# EasyEDA Pro project smart-switch-v2.eprj, schematic main-board
Board Name: main-board; Create Date: 2025-08-24; Page Name: main-board; Project Name: smart-switch-v2; Schematic Name: main-board; Update Date: 2025-10-11; Version: V1.0
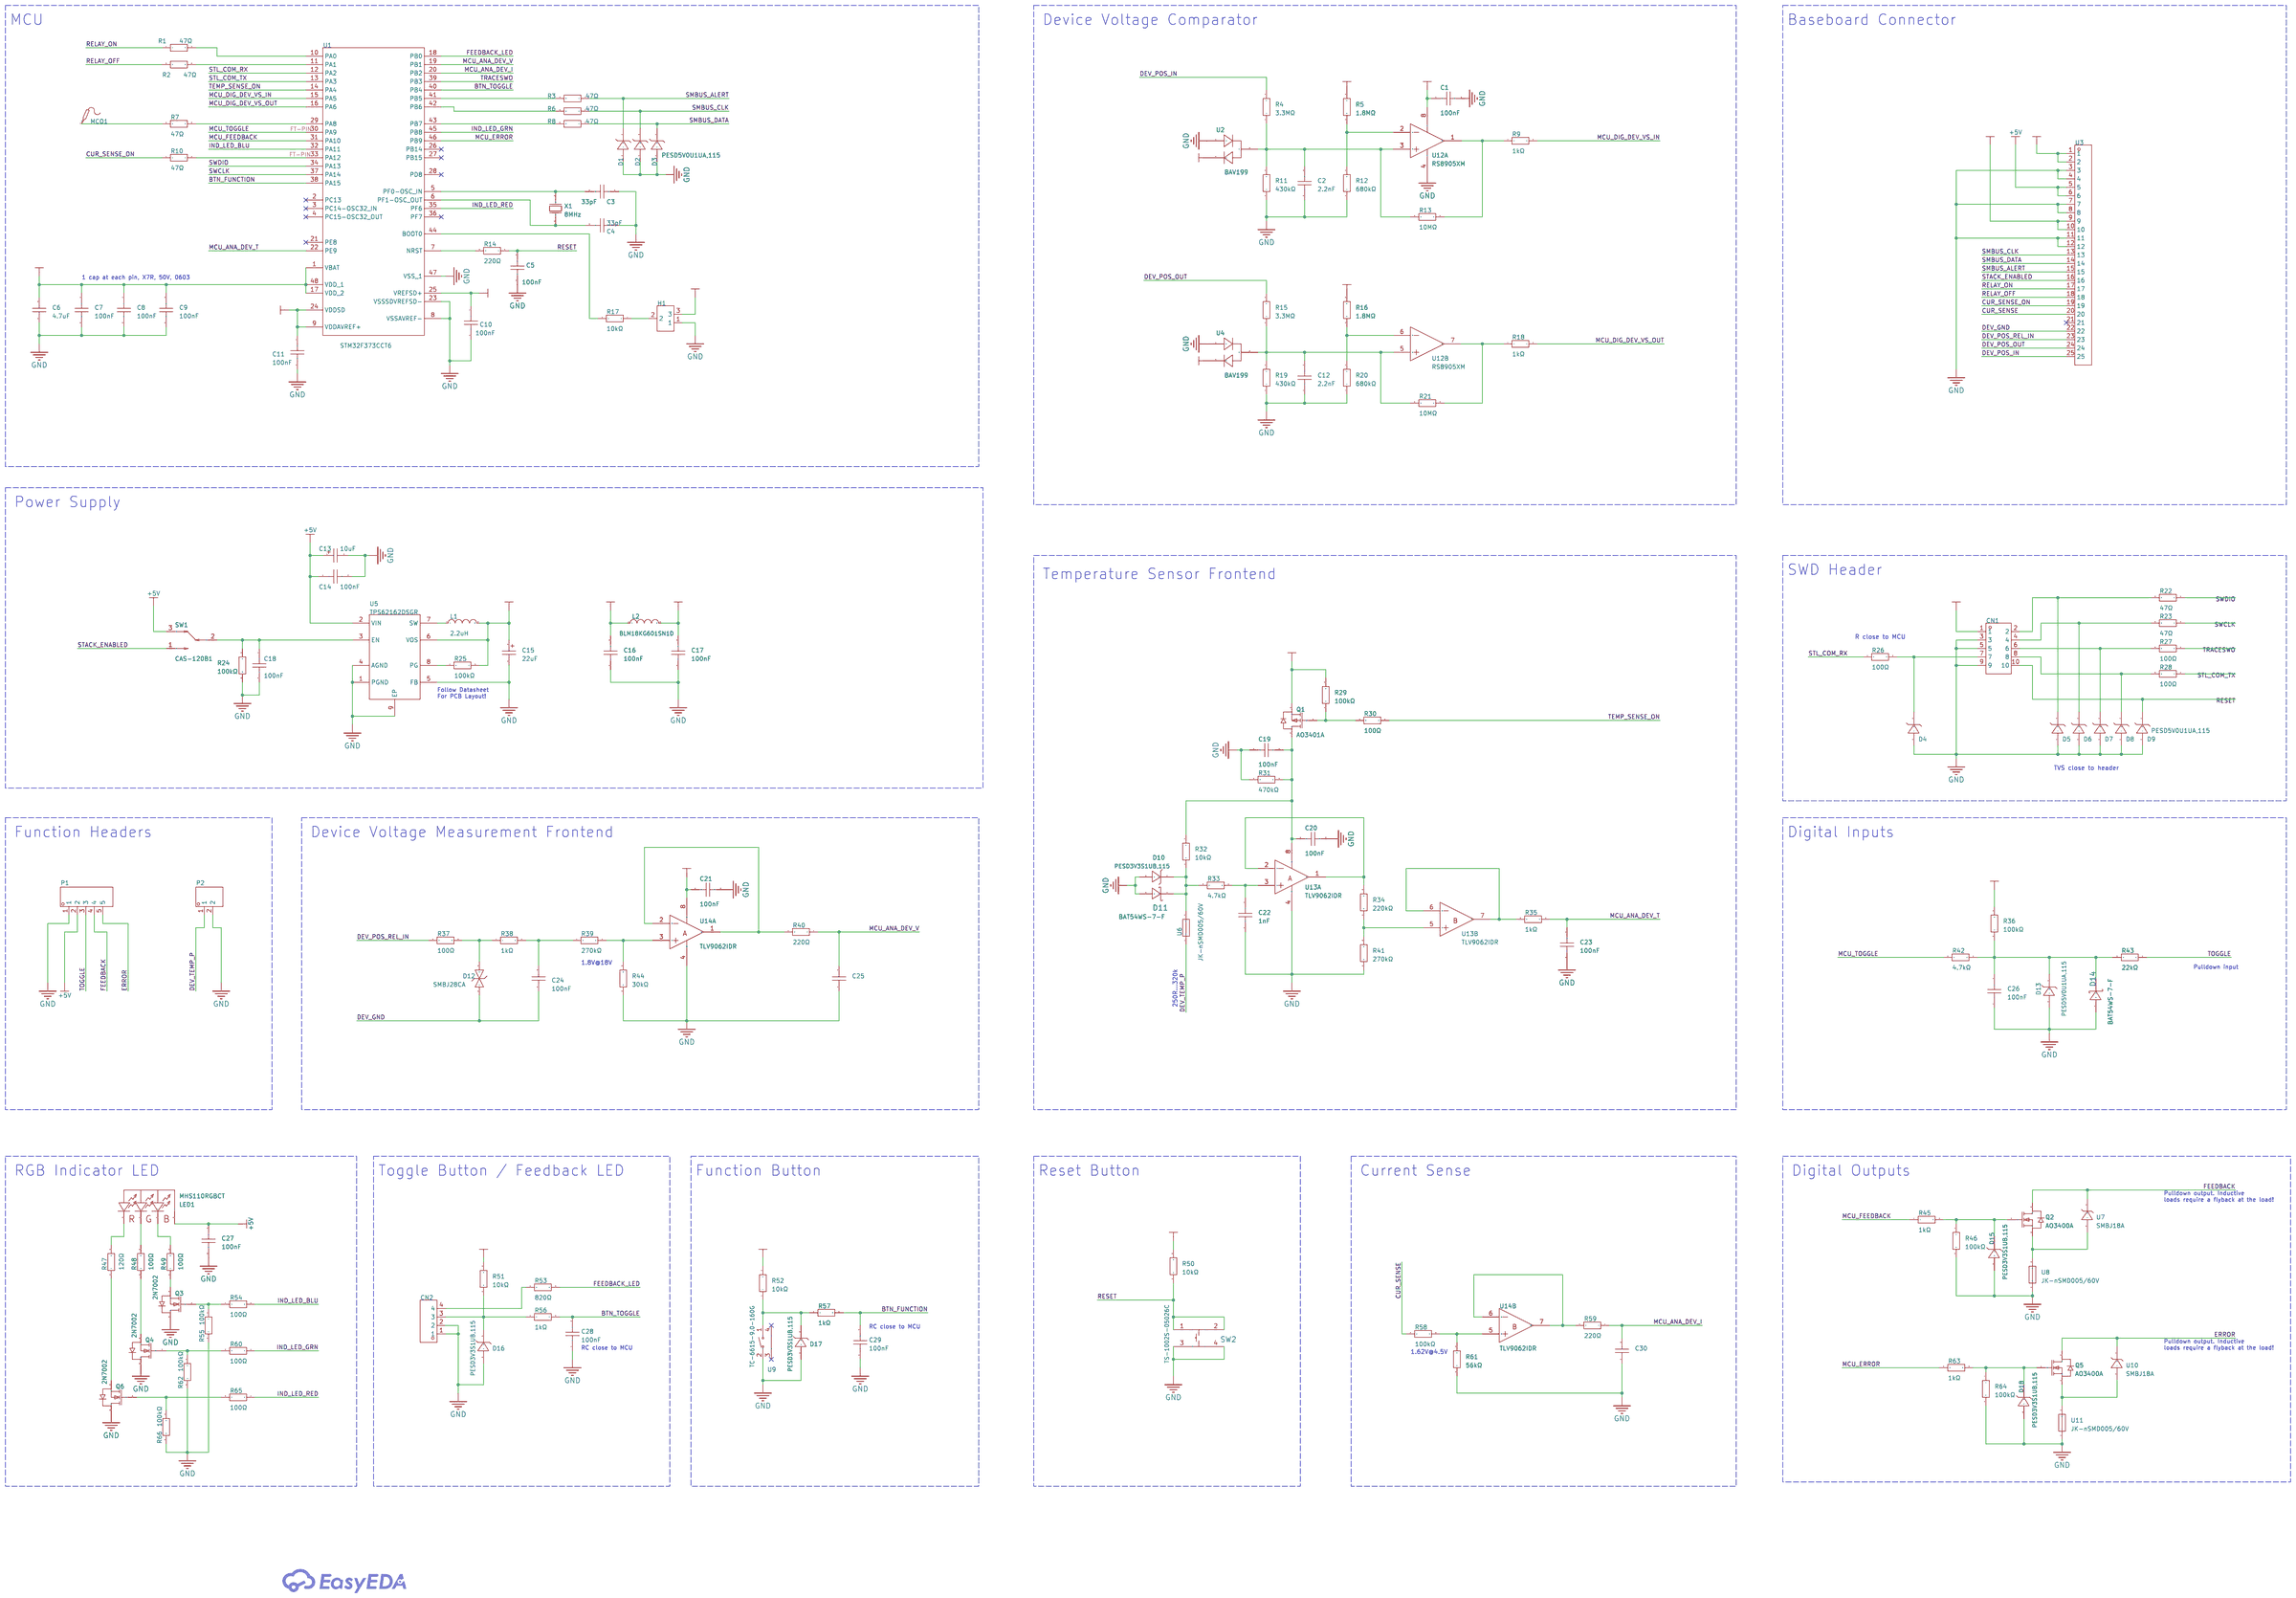
[diagram p0: schematic sheet]

## Parts
C1  100nF  [C0603]
C2  2.2nF  [C0603]
C3  33pF  [C0603]
C4  33pF  [C0603]
C5  100nF  [C0603]
C6  4.7uF  [C0805]
C7  100nF  [C0603]
C8  100nF  [C0603]
C9  100nF  [C0603]
C10  100nF  [C0603]
C11  100nF  [C0603]
C12  2.2nF  [C0603]
C13  10uF  [C0805]
C14  100nF  [C0603]
C15  22uF  [C1206]
C16  100nF  [C0603]
C17  100nF  [C0603]
C18  100nF  [C0603]
C19  100nF  [C0603]
C20  100nF  [C0603]
C21  100nF  [C0603]
C22  1nF  [C0603]
C23  100nF  [C0603]
C24  100nF  [C0805]
C25  22nF  [C0603]
C26  100nF  [C0603]
C27  100nF  [C0603]
C28  100nF  [C0603]
C29  100nF  [C0603]
C30  22nF  [C0603]
CN1  X9555WR-2x05-6TV01  [IDC-TH_10P-P2.54-H-R2-C5-S2.54]
CN2  ZX-XH2.54-4PZZ  [CONN-TH_4P-P2.50_4PIN]
D1  PESD5V0U1UA,115  [SOD-323_L1.8-W1.3-LS2.5-RD]
D2  PESD5V0U1UA,115  [SOD-323_L1.8-W1.3-LS2.5-RD]
D3  PESD5V0U1UA,115  [SOD-323_L1.8-W1.3-LS2.5-RD]
D4  PESD5V0U1UA,115  [SOD-323_L1.8-W1.3-LS2.5-RD]
D5  PESD5V0U1UA,115  [SOD-323_L1.8-W1.3-LS2.5-RD]
D6  PESD5V0U1UA,115  [SOD-323_L1.8-W1.3-LS2.5-RD]
D7  PESD5V0U1UA,115  [SOD-323_L1.8-W1.3-LS2.5-RD]
D8  PESD5V0U1UA,115  [SOD-323_L1.8-W1.3-LS2.5-RD]
D9  PESD5V0U1UA,115  [SOD-323_L1.8-W1.3-LS2.5-RD]
D10  PESD3V3S1UB,115  [SOD-523_L1.2-W0.8-LS1.6-RD]
D11  BAT54WS-7-F  [SOD-323_L1.8-W1.3-LS2.5-RD]
D12  SMBJ28CA  [SMB_L4.6-W3.6-LS5.3-BI]
D13  PESD5V0U1UA,115  [SOD-323_L1.8-W1.3-LS2.5-RD]
D14  BAT54WS-7-F  [SOD-323_L1.8-W1.3-LS2.5-RD]
D15  PESD3V3S1UB,115  [SOD-523_L1.2-W0.8-LS1.6-RD]
D16  PESD3V3S1UB,115  [SOD-523_L1.2-W0.8-LS1.6-RD]
D17  PESD3V3S1UB,115  [SOD-523_L1.2-W0.8-LS1.6-RD]
D18  PESD3V3S1UB,115  [SOD-523_L1.2-W0.8-LS1.6-RD]
H1  X6511WVS-03H-C60D48R2  [HDR-SMD_3P-P2.54_XKB_X6511WVS-03H-C60D48R2]
L1  2.2uH  [IND-SMD_L2.0-W1.6-1]
L2  BLM18KG601SN1D  [L0603]
LED1  MHS110RGBCT  [LED-ARRAY-SMD_MHS110RGBCT]
MCO1  -  [Test-Point-0.5mm]
P1  WJ15EDGRC-3.81-5P  [CONN-TH_5P-P3.81_WJ15EDGRC-3.81-5P]
P2  WJ15EDGRC-3.81-2P  [CONN-TH_2P-P3.81_WJ15EDGRC-3.81-2P]
Q1  AO3401A  [SOT-23_L2.9-W1.3-P1.90-LS2.4-BR]
Q2  AO3400A  [SOT-23-3_L2.9-W1.3-P1.90-LS2.4-BR]
Q3  2N7002  [SOT-23-3_L2.9-W1.3-P1.90-LS2.4-BR]
Q4  2N7002  [SOT-23-3_L2.9-W1.3-P1.90-LS2.4-BR]
Q5  AO3400A  [SOT-23-3_L2.9-W1.3-P1.90-LS2.4-BR]
Q6  2N7002  [SOT-23-3_L2.9-W1.3-P1.90-LS2.4-BR]
R1  47Ω  [R0603]
R2  47Ω  [R0603]
R3  47Ω  [R0603]
R4  3.3MΩ  [R0603]
R5  1.8MΩ  [R0603]
R6  47Ω  [R0603]
R7  47Ω  [R0603]
R8  47Ω  [R0603]
R9  1kΩ  [R0603]
R10  47Ω  [R0603]
R11  430kΩ  [R0603]
R12  680kΩ  [R0603]
R13  10MΩ  [R0603]
R14  220Ω  [R0603]
R15  3.3MΩ  [R0603]
R16  1.8MΩ  [R0603]
R17  10kΩ  [R0603]
R18  1kΩ  [R0603]
R19  430kΩ  [R0603]
R20  680kΩ  [R0603]
R21  10MΩ  [R0603]
R22  47Ω  [R0603]
R23  47Ω  [R0603]
R24  100kΩ  [R0603]
R25  100kΩ  [R0603]
R26  100Ω  [R0603]
R27  100Ω  [R0603]
R28  100Ω  [R0603]
R29  100kΩ  [R0603]
R30  100Ω  [R0603]
R31  470kΩ  [R0603]
R32  10kΩ  [R0603]
R33  4.7kΩ  [R0603]
R34  220kΩ  [R0603]
R35  1kΩ  [R0603]
R36  100kΩ  [R0603]
R37  100Ω  [R1206]
R38  1kΩ  [R0603]
R39  270kΩ  [R0603]
R40  220Ω  [R0603]
R41  270kΩ  [R0603]
R42  4.7kΩ  [R0603]
R43  22kΩ  [R0603]
R44  30kΩ  [R0603]
R45  1kΩ  [R0603]
R46  100kΩ  [R0603]
R47  120Ω  [R0603]
R48  100Ω  [R0603]
R49  100Ω  [R0603]
R50  10kΩ  [R0603]
R51  10kΩ  [R0603]
R52  10kΩ  [R0603]
R53  820Ω  [R0603]
R54  100Ω  [R0603]
R55  100kΩ  [R0603]
R56  1kΩ  [R0603]
R57  1kΩ  [R0603]
R58  100kΩ  [R0603]
R59  220Ω  [R0603]
R60  100Ω  [R0603]
R61  56kΩ  [R0603]
R62  100kΩ  [R0603]
R63  1kΩ  [R0603]
R64  100kΩ  [R0603]
R65  100Ω  [R0603]
R66  100kΩ  [R0603]
SW1  CAS-120B1  [SW-SMD_NIDEC_CAS-120B1]
SW2  TS-1002S-05026C  [KEY-SMD_4P-L6.0-W6.0-P4.50-LS9.0]
U1  STM32F373CCT6  [LQFP-48_L7.0-W7.0-P0.50-LS9.0-BL]
U2  BAV199  [SOT-23-3_L2.9-W1.3-P0.95-LS2.4-BR]
U3  KH-2PH90-1X25P-L10.5  [HDR-TH_25P-P2.00-H-M-W7.5-N]
U4  BAV199  [SOT-23-3_L2.9-W1.3-P0.95-LS2.4-BR]
U5  TPS62162DSGR  [WSON-8_L2.0-W2.0-P0.50-TL-EP]
U6  JK-nSMD005/60V  [F1206]
U7  SMBJ18A  [SMB_L4.5-W3.6-LS5.4-RD]
U8  JK-nSMD005/60V  [F1206]
U9  TC-6615-9.0-160G  [KEY-TH_PTS645VXX83XLFS]
U10  SMBJ18A  [SMB_L4.5-W3.6-LS5.4-RD]
U11  JK-nSMD005/60V  [F1206]
U12  RS8905XM  [MSOP-8_L3.0-W3.0-P0.65-LS4.9-BL]  (sections 1,2)
U13  TLV9062IDR  [SOIC-8_L5.0-W4.0-P1.27-LS6.0-BL]  (sections 1,2)
U14  TLV9062IDR  [SOIC-8_L5.0-W4.0-P1.27-LS6.0-BL]  (sections 1,2)
X1  8MHz  [CRYSTAL-SMD_L5.0-W3.2]

## Library data of the parts
C1 C5 C7-C11 C14 C16-C21 C23 C26-C29 = CC0603KRX7R9BB104: Capacitance:100nF Tolerance:±10% Tolerance:±10% Voltage Rating:50V Temperature Coefficient:X7R; LCSC Part Name: 100nF ±10% 50V; Supplier Part: C14663; Manufacturer: YAGEO(国巨); Supplier Footprint: 0603; JLCPCB Part Class: Basic Part; Datasheet: https://item.szlcsc.com/datasheet/CC0603KRX7R9BB104/15331.html; Supplier: LCSC; Tolerance: ±10%; Voltage Rating: 50V; Temperature Coefficient: X7R
C2 C12 = 0603B222K500NT: Capacitance:2.2nF Tolerance:±10% Tolerance:±10% Voltage Rating:50V Temperature Coefficient:X7R; LCSC Part Name: 2.2nF ±10% 50V; Supplier Part: C1604; Manufacturer: FH(风华); Supplier Footprint: 0603; JLCPCB Part Class: Basic Part; Datasheet: https://item.szlcsc.com/datasheet/0603B222K500NT/1956.html; Supplier: LCSC; Tolerance: ±10%; Voltage Rating: 50V; Temperature Coefficient: X7R
C3 C4 = CL10C330JB8NNNC: Capacitance:33pF Tolerance:±5% Tolerance:±5% Voltage Rating:50V Temperature Coefficient:C0G; LCSC Part Name: 33pF ±5% 50V; Supplier Part: C1663; Manufacturer: SAMSUNG(三星); Supplier Footprint: 0603; JLCPCB Part Class: Basic Part; Datasheet: https://item.szlcsc.com/datasheet/CL10C330JB8NNNC/2015.html; Supplier: LCSC; Tolerance: ±5%; Voltage Rating: 50V; Temperature Coefficient: C0G
C6 = CL21A475KAQNNNE: Capacitance:4.7uF Tolerance:±10% Tolerance:±10% Voltage Rating:25V Temperature Coefficient:X5R; LCSC Part Name: 4.7uF ±10% 25V; Supplier Part: C1779; Manufacturer: SAMSUNG(三星); Supplier Footprint: 0805; JLCPCB Part Class: Basic Part; Datasheet: https://item.szlcsc.com/datasheet/CL21A475KAQNNNE/2131.html; Supplier: LCSC; Tolerance: ±10%; Voltage Rating: 25V; Temperature Coefficient: X5R
C13 = CL21A106KAYNNNE_C15850: Capacitance:10uF Tolerance:±10% Tolerance:±10% Voltage Rating:25V Temperature Coefficient:X5R; LCSC Part Name: 10uF ±10% 25V; Supplier Part: C15850; Manufacturer: SAMSUNG(三星); Manufacturer Part: CL21A106KAYNNNE; Supplier Footprint: 0805; JLCPCB Part Class: Basic Part; Datasheet: https://item.szlcsc.com/datasheet/CL21A106KAYNNNE/16532.html; Supplier: LCSC; Tolerance: ±10%; Voltage Rating: 25V; Temperature Coefficient: X5R
C15 = CL31A226KAHNNNE: Capacitance:22uF Tolerance:±10% Tolerance:±10% Voltage Rating:25V Temperature Coefficient:X5R; LCSC Part Name: 22uF ±10% 25V; Supplier Part: C12891; Manufacturer: SAMSUNG(三星); Supplier Footprint: 1206; JLCPCB Part Class: Basic Part; Datasheet: https://item.szlcsc.com/datasheet/CL31A226KAHNNNE/13537.html; Supplier: LCSC; Tolerance: ±10%; Voltage Rating: 25V; Temperature Coefficient: X5R
C22 = CL10B102KB8NNNC: Capacitance:1nF Tolerance:±10% Tolerance:±10% Voltage Rating:50V Temperature Coefficient:X7R; LCSC Part Name: 1nF ±10% 50V; Supplier Part: C1588; Manufacturer: SAMSUNG(三星); Supplier Footprint: 0603; JLCPCB Part Class: Basic Part; Datasheet: https://item.szlcsc.com/datasheet/CL10B102KB8NNNC/1940.html; Supplier: LCSC; Tolerance: ±10%; Voltage Rating: 50V; Temperature Coefficient: X7R
C24 = CL21B104KCFNNNE: LCSC Part Name: 100nF ±10% 100V; Supplier Part: C28233; Manufacturer: SAMSUNG(三星); Supplier Footprint: 0805; JLCPCB Part Class: Basic Part; Datasheet: https://item.szlcsc.com/datasheet/CL21B104KCFNNNE/28983.html; Supplier: LCSC; Tolerance: ±10%; Voltage Rating: 100V; Temperature Coefficient: X7R
C25 C30 = CL10B223KB8NNNC: Capacitance:22nF Tolerance:±10% Tolerance:±10% Voltage Rating:50V Temperature Coefficient:X7R; LCSC Part Name: 22nF ±10% 50V; Supplier Part: C21122; Manufacturer: SAMSUNG(三星); Supplier Footprint: 0603; JLCPCB Part Class: Basic Part; Datasheet: https://item.szlcsc.com/datasheet/CL10B223KB8NNNC/21834.html; Supplier: LCSC; Tolerance: ±10%; Voltage Rating: 50V; Temperature Coefficient: X7R
CN1 = X9555WR-2x05-6TV01: LCSC Part Name: 2x5P 间距:2.54mm 弯插; Supplier Part: C2682217; Manufacturer: XKB Connection(中国星坤); Supplier Footprint: 弯插,P=2.54mm; JLCPCB Part Class: Extended Part; Datasheet: https://atta.szlcsc.com/upload/public/pdf/source/20211009/ED69AC5D0B165AFEE3838F4DF324EF6E.pdf; Supplier: LCSC; Pins Structure: 2x5P; Pitch: 2.54mm; Mounting Style: Bend-in; Number of Pins: 10P; Number of Rows: 2; Number of PINs Per Row: 5; Row Spacing: 2.54mm; Current Rating (Max): 3A; Contact Material: Brass; Contact Plating: Tin
CN2 = ZX-XH2.54-4PZZ: LCSC Part Name: 1x4P 间距:2.5mm 直插 系列:XH; Supplier Part: C7429634; Manufacturer: Megastar(兆星); Supplier Footprint: 插件,P=2.5mm; JLCPCB Part Class: Extended Part; Datasheet: https://item.szlcsc.com/datasheet/ZX-XH2.54-4PZZ/8427551.html; Supplier: LCSC; Pins Structure: 1x4P; Pitch: 2.5mm; Mounting Type: Through Hole; Reference Series: XH; Number of Pins: 4P; Number of Rows: 1; Number of PINs Per Row: 4; Current Rating: 3A; Contact Material: Brass; Contact Plating: Tin; Operating Temperature: -25℃~+85℃; Voltage Rating: 250V; Plastic Material: PA66; Flame Retardant Rating: UL94V-0; Color: White; Z-Height of the Board: 7mm; X-Length of Bottom Edge on Board (Spacing Line): 12.5mm; Y-Width of Bottom Edge on Board: 5.9mm
D1-D9 D13 = PESD5V0U1UA,115: LCSC Part Name: 单向ESD; Supplier Part: C139614; Manufacturer: Nexperia(安世); Supplier Footprint: SOD-323; JLCPCB Part Class: Extended Part; Datasheet: https://item.szlcsc.com/datasheet/PESD5V0U1UA%252C115/150939.html; Supplier: LCSC; Polarity: Unidirectional; Reverse Stand-Off Voltage (Vrwm): 5V; Clamping Voltage: 11V; Peak Pulse Current (Ipp): 1.3A@8/20us; Voltage - Breakdown: 8.8V; Reverse Leakage Current (Ir): 1nA; Number of Channels: 1; Operating Temperature: -55℃~+150℃@(Ta); level of protection: IEC 61000-4-2; Type: ESD; Junction Capacitance: 2pF
D10 D15-D18 = PESD3V3S1UB,115: LCSC Part Name: 单向ESD; Supplier Part: C85377; Manufacturer: Nexperia(安世); Supplier Footprint: SC-79(SOD-523); JLCPCB Part Class: Extended Part; Datasheet: https://item.szlcsc.com/datasheet/PESD3V3S1UB%252C115/86550.html; Supplier: LCSC; Polarity: Unidirectional; Reverse Stand-Off Voltage (Vrwm): 3.3V; Clamping Voltage: 20V; Peak Pulse Current (Ipp): 18A; Peak Pulse Power Dissipation (Ppp): 330W; Voltage - Breakdown: 5.2V; Number of Channels: 1; Operating Temperature: -65℃~+150℃@(Ta); Type: ESD
D11 D14 = BAT54WS-7-F: LCSC Part Name: 电压:30V 电流:100mA; Supplier Part: C124205; Manufacturer: DIODES(美台); Supplier Footprint: SOD-323; JLCPCB Part Class: Extended Part; Datasheet: https://item.szlcsc.com/datasheet/BAT54WS-7-F/125480.html; Supplier: LCSC; Voltage - Forward(Vf@If): 1V@100mA; Voltage - DC Reverse(Vr): 30V; Current - Rectified: 100mA; Reverse Leakage Current (Ir): 2uA@25V; Non-Repetitive Peak Forward Surge Current: 600mA
D12 = SMBJ28CA_C726872: LCSC Part Name: 双向TVS 28V截止 峰值浪涌电流：13.3A@10/1000us; Supplier Part: C726872; Manufacturer: TWGMC(迪嘉); Supplier Footprint: DO-214AA(SMB); JLCPCB Part Class: Extended Part; Datasheet: https://item.szlcsc.com/datasheet/SMBJ28CA/773977.html; Supplier: LCSC; Polarity: Bidirectional; Reverse Stand-Off Voltage (Vrwm): 28V; Clamping Voltage: 45.4V; Peak Pulse Current (Ipp): 13.3A@10/1000us; Peak Pulse Power Dissipation (Ppp): 600W@10/1000us; Voltage - Breakdown: 34.4V; Reverse Leakage Current (Ir): 1uA; Operating Temperature: -65℃~+150℃; Type: TVS; Junction Capacitance: 390pF
H1 = X6511WVS-03H-C60D48R2: LCSC Part Name: 1x3P 间距:2.54mm 方针; Supplier Part: C2883760; Manufacturer: XKB Connection(中国星坤); Supplier Footprint: SMD,P=2.54mm; JLCPCB Part Class: Extended Part; Datasheet: https://atta.szlcsc.com/upload/public/pdf/source/20200909/C780060_F941EB1B69F43B5D6329EAF74E2E27BB.pdf; Supplier: LCSC; Pin Structure: 1x3P; Pitch: 2.54mm; Row Spacing: 2.54mm; Circluar Pins/Square Pins: Policy; Number of Rows: Single Row; Number of Pins: 3P; Current Rating: 3A; Voltage Rating (Max): 250V; Insulation Height: 2.5mm; Contact Material: Brass; Contact Plating: Gold; Operating Temperature: -40℃~+105℃; Color: Black
L1 = TFM201610ALMA2R2MTAA: LCSC Part Name: 2.2uH ±20% 2A; Supplier Part: C404810; Manufacturer: TDK; Supplier Footprint: SMD,1.6x2mm; JLCPCB Part Class: Extended Part; Datasheet: https://atta.szlcsc.com/upload/public/pdf/source/20190717/C404810_ABF5B38A636D8F3C7C774ECB5D7697CD.pdf; Supplier: LCSC; Tolerance: ±20%; Ratings: AEC-Q200
L2 = BLM18KG601SN1D: LCSC Part Name: 单路 0603磁珠 阻抗600Ω@100MHz; Supplier Part: C85833; Manufacturer: muRata(村田); Supplier Footprint: 0603; JLCPCB Part Class: Extended Part; Datasheet: https://item.szlcsc.com/datasheet/BLM18KG601SN1D/87009.html; Supplier: LCSC; Impedance @ Frequency: 600Ω@100MHz; Tolerance: ±25%; DC Resistance(DCR): 150mΩ; Current Rating: 1.3A; Number of Circuits: 1; Operating Temperature: -55℃~+125℃
LED1 = MHS110RGBCT: LCSC Part Name: RGB三色 侧贴; Supplier Part: C389528; Manufacturer: MEIHUA(美华); Supplier Footprint: SMD,1.5x3mm; JLCPCB Part Class: Extended Part; Datasheet: https://atta.szlcsc.com/upload/public/pdf/source/20190530/C389528_18CC971B89683121AF99AD38EE2CA1FC.pdf; Supplier: LCSC
MCO1 = Test-Point: MCO
P1 = WJ15EDGRC-3.81-5P: LCSC Part Name: 1x5P 3.81mm 排数:1 每排P数:5; Supplier Part: C8395; Manufacturer: KANGNEX(康奈克斯电气); Supplier Footprint: 弯插,P=3.81mm; JLCPCB Part Class: Extended Part; Datasheet: https://item.szlcsc.com/datasheet/WJ15EDGRC-3.81-5P/8889.html; Supplier: LCSC; Connector Type: Board Side/Socket - Closed; Number of Positions or Pins: 1x5P; Pitch: 3.81mm; Mounting Type: Right-Angle Pin; Number of Pins: 5P; Number of Rows: 1; Number of PINs Per Row: 5; Operating Temperature: -40℃~+105℃
P2 = WJ15EDGRC-3.81-2P: LCSC Part Name: 1x2P 3.81mm 排数:1 每排P数:2; Supplier Part: C8387; Manufacturer: KANGNEX(康奈克斯电气); Supplier Footprint: 弯插,P=3.81mm; JLCPCB Part Class: Extended Part; Datasheet: https://item.szlcsc.com/datasheet/WJ15EDGRC-3.81-2P/8881.html; Supplier: LCSC; Connector Type: Board Side/Socket - Closed; Number of Positions or Pins: 1x2P; Pitch: 3.81mm; Mounting Type: Right-Angle Pin; Number of Pins: 2P; Number of Rows: 1; Number of PINs Per Row: 2; Operating Temperature: -40℃~+105℃
Q1 = AO3401A_C15127: LCSC Part Name: 1个P沟道 耐压:30V 电流:4A; Supplier Part: C15127; Manufacturer: AOS; Supplier Footprint: SOT-23; JLCPCB Part Class: Basic Part; Datasheet: https://item.szlcsc.com/datasheet/AO3401A/15801.html; Supplier: LCSC; Number: 1 P-Channel; Drain to Source Voltage: 30V; Current - Continuous Drain(Id): 4A; RDS(on): 47mΩ@10V；85mΩ@2.5V；60mΩ@4.5V; Gate Threshold Voltage (Vgs(th)): 900mV@250uA; Gate Charge(Qg): 14nC@10V; Input Capacitance(Ciss): 645pF; Reverse Transfer Capacitance (Crss@Vds): 55pF; Output Capacitance(Coss): 80pF
Q2 Q5 = AO3400A_C20917: LCSC Part Name: 1个N沟道 耐压:30V 电流:5.7A; Supplier Part: C20917; Manufacturer: AOS; Supplier Footprint: SOT-23-3L; JLCPCB Part Class: Basic Part; Datasheet: https://item.szlcsc.com/datasheet/AO3400A/21629.html; Supplier: LCSC; Drain to Source Voltage: 30V; RDS(on): 48mΩ@2.5V; Gate Threshold Voltage (Vgs(th)): 1.45V@250uA; Gate Charge(Qg): 7nC@10V; Input Capacitance(Ciss): 630pF@15V; Operating Temperature: -55℃~+150℃@(Tj); Type: N-Channel
Q3 Q4 Q6 = 2N7002_C8545: LCSC Part Name: 1个N沟道 耐压:60V 电流:115mA; Supplier Part: C8545; Manufacturer: CJ(江苏长电/长晶); Supplier Footprint: SOT-23; JLCPCB Part Class: Basic Part; Datasheet: https://item.szlcsc.com/datasheet/2N7002/9040.html; Supplier: LCSC; Number: 1 N-Channel; Drain to Source Voltage: 60V; Current - Continuous Drain(Id): 115mA; RDS(on): 5Ω@10V; Pd - Power Dissipation: 225mW; Gate Threshold Voltage (Vgs(th)): 2.5V; Input Capacitance(Ciss): 50pF; Reverse Transfer Capacitance (Crss@Vds): 5pF
R1-R3 R6-R8 R10 R22 R23 = 0603WAF470JT5E: Type:Thick Film Resistor Resistance:47Ω Tolerance:±1% Tolerance:±1% Power(Watts):100mW Voltage-Supply(Max):75V Temperature Coefficient:±100ppm/℃ Temperature Coefficient:±100ppm/℃ Operating Temperature:-55℃~+155℃ Operating Temperature:-55℃~+155℃; LCSC Part Name: 47Ω ±1% 100mW 厚膜电阻; Supplier Part: C23182; Manufacturer: UNI-ROYAL(厚声); Supplier Footprint: 0603; JLCPCB Part Class: Basic Part; Datasheet: https://item.szlcsc.com/datasheet/0603WAF470JT5E/23909.html; Supplier: LCSC; Type: Thick Film Resistor; Tolerance: ±1%; Power(Watts): 100mW; Voltage-Supply(Max): 75V; Temperature Coefficient: ±100ppm/℃; Operating Temperature: -55℃~+155℃
R4 R15 = 0603WAF3304T5E: Type:Thick Film Resistor Resistance:3.3MΩ Tolerance:±1% Tolerance:±1% Power(Watts):100mW Voltage-Supply(Max):75V Temperature Coefficient:±100ppm/℃ Temperature Coefficient:±100ppm/℃ Operating Temperature:-55℃~+155℃ Operating Temperature:-55℃~+155℃; LCSC Part Name: 3.3MΩ ±1% 100mW 厚膜电阻; Supplier Part: C26096; Manufacturer: UNI-ROYAL(厚声); Supplier Footprint: 0603; JLCPCB Part Class: Extended Part; Datasheet: https://item.szlcsc.com/datasheet/0603WAF3304T5E/26839.html; Supplier: LCSC; Type: Thick Film Resistor; Tolerance: ±1%; Power(Watts): 100mW; Voltage-Supply(Max): 75V; Temperature Coefficient: ±100ppm/℃; Operating Temperature: -55℃~+155℃
R5 R16 = FRC0603F1804TS: Type:Thick Film Resistor Resistance:1.8MΩ Tolerance:±1% Tolerance:±1% Power(Watts):100mW Voltage-Supply(Max):75V Temperature Coefficient:±100ppm/℃ Temperature Coefficient:±100ppm/℃ Operating Temperature:-55℃~+155℃ Operating Temperature:-55℃~+155℃; LCSC Part Name: 1.8MΩ ±1% 100mW 厚膜电阻; Supplier Part: C2933162; Manufacturer: FOJAN(富捷); Supplier Footprint: 0603; JLCPCB Part Class: Extended Part; Supplier: LCSC; Type: Thick Film Resistor; Tolerance: ±1%; Power(Watts): 100mW; Voltage-Supply(Max): 75V; Temperature Coefficient: ±100ppm/℃; Operating Temperature: -55℃~+155℃
R9 R18 R35 R38 R45 R56 R57 R63 = 0603WAF1001T5E: Type:Thick Film Resistors Resistance:1kΩ Tolerance:±1% Tolerance:±1% Power(Watts): Overload Voltage (Max): Temperature Coefficient:±100ppm/℃ Temperature Coefficient:±100ppm/℃ Operating Temperature Range:-55℃~+155℃ Operating Temperature Range:-55℃~+155℃; LCSC Part Name: 1kΩ ±1% 100mW 厚膜电阻; Supplier Part: C21190; Manufacturer: UNI-ROYAL(厚声); Supplier Footprint: 0603; JLCPCB Part Class: Basic Part; Datasheet: https://atta.szlcsc.com/upload/public/pdf/source/20200306/C422600_1E6D84923E4A46A82E41ADD87F860B5C.pdf; Supplier: LCSC; Type: Thick Film Resistors; Tolerance: ±1%; Temperature Coefficient: ±100ppm/℃; Operating Temperature Range: -55℃~+155℃
R11 R19 = 0603WAF4303T5E: Type:Thick Film Resistor Resistance:430kΩ Tolerance:±1% Tolerance:±1% Power(Watts):100mW Voltage-Supply(Max):75V Temperature Coefficient:±100ppm/℃ Temperature Coefficient:±100ppm/℃ Operating Temperature:-55℃~+155℃ Operating Temperature:-55℃~+155℃; LCSC Part Name: 430kΩ ±1% 100mW 厚膜电阻; Supplier Part: C25969; Manufacturer: UNI-ROYAL(厚声); Supplier Footprint: 0603; JLCPCB Part Class: Extended Part; Datasheet: https://item.szlcsc.com/datasheet/0603WAF4303T5E/26712.html; Supplier: LCSC; Type: Thick Film Resistor; Tolerance: ±1%; Power(Watts): 100mW; Voltage-Supply(Max): 75V; Temperature Coefficient: ±100ppm/℃; Operating Temperature: -55℃~+155℃
R12 R20 = 0603WAF6803T5E: Type:Thick Film Resistor Resistance:680kΩ Tolerance:±1% Tolerance:±1% Power(Watts):100mW Voltage-Supply(Max):75V Temperature Coefficient:±100ppm/℃ Temperature Coefficient:±100ppm/℃ Operating Temperature:-55℃~+155℃ Operating Temperature:-55℃~+155℃; LCSC Part Name: 680kΩ ±1% 100mW 厚膜电阻; Supplier Part: C25822; Manufacturer: UNI-ROYAL(厚声); Supplier Footprint: 0603; JLCPCB Part Class: Extended Part; Datasheet: https://item.szlcsc.com/datasheet/0603WAF6803T5E/26565.html; Supplier: LCSC; Type: Thick Film Resistor; Tolerance: ±1%; Power(Watts): 100mW; Voltage-Supply(Max): 75V; Temperature Coefficient: ±100ppm/℃; Operating Temperature: -55℃~+155℃
R13 R21 = 0603WAF1005T5E: Type:Thick Film Resistors Resistance:10MΩ Tolerance:±1% Tolerance:±1% Power(Watts): Overload Voltage (Max): Temperature Coefficient:±100ppm/℃ Temperature Coefficient:±100ppm/℃ Operating Temperature Range:-55℃~+155℃ Operating Temperature Range:-55℃~+155℃; LCSC Part Name: 10MΩ ±1% 100mW 厚膜电阻; Supplier Part: C7250; Manufacturer: UNI-ROYAL(厚声); Supplier Footprint: 0603; JLCPCB Part Class: Basic Part; Datasheet: https://atta.szlcsc.com/upload/public/pdf/source/20200306/C422600_1E6D84923E4A46A82E41ADD87F860B5C.pdf; Supplier: LCSC; Type: Thick Film Resistors; Tolerance: ±1%; Temperature Coefficient: ±100ppm/℃; Operating Temperature Range: -55℃~+155℃
R14 R40 R59 = 0603WAF2200T5E: Type:Thick Film Resistors Resistance: Tolerance:±1% Tolerance:±1% Power(Watts): Overload Voltage (Max): Temperature Coefficient:±100ppm/℃ Temperature Coefficient:±100ppm/℃ Operating Temperature Range:-55℃~+155℃ Operating Temperature Range:-55℃~+155℃; LCSC Part Name: 220Ω ±1% 100mW 厚膜电阻; Supplier Part: C22962; Manufacturer: UNI-ROYAL(厚声); Supplier Footprint: 0603; JLCPCB Part Class: Basic Part; Datasheet: https://atta.szlcsc.com/upload/public/pdf/source/20200306/C422600_1E6D84923E4A46A82E41ADD87F860B5C.pdf; Supplier: LCSC; Type: Thick Film Resistors; Tolerance: ±1%; Temperature Coefficient: ±100ppm/℃; Operating Temperature Range: -55℃~+155℃
R17 R32 R50-R52 = 0603WAF1002T5E: Type:Thick Film Resistor Resistance:10kΩ Tolerance:±1% Tolerance:±1% Power(Watts):100mW Voltage-Supply(Max):75V Temperature Coefficient:±100ppm/℃ Temperature Coefficient:±100ppm/℃ Operating Temperature:-55℃~+155℃ Operating Temperature:-55℃~+155℃; LCSC Part Name: 厚膜电阻 10kΩ ±1% 100mW; Supplier Part: C25804; Manufacturer: UNI-ROYAL(厚声); Supplier Footprint: 0603; JLCPCB Part Class: Basic Part; Datasheet: https://item.szlcsc.com/datasheet/0603WAF1002T5E/26547.html; Supplier: LCSC; Type: Thick Film Resistor; Tolerance: ±1%; Power(Watts): 100mW; Voltage-Supply(Max): 75V; Temperature Coefficient: ±100ppm/℃; Operating Temperature: -55℃~+155℃
R24 R25 R29 R36 R46 R55 R58 R62 R64 R66 = 0603WAF1003T5E: Type:Thick Film Resistor Resistance:100kΩ Tolerance:±1% Tolerance:±1% Power(Watts):100mW Voltage-Supply(Max):75V Temperature Coefficient:±100ppm/℃ Temperature Coefficient:±100ppm/℃ Operating Temperature:-55℃~+155℃ Operating Temperature:-55℃~+155℃; LCSC Part Name: 100kΩ ±1% 100mW 厚膜电阻; Supplier Part: C25803; Manufacturer: UNI-ROYAL(厚声); Supplier Footprint: 0603; JLCPCB Part Class: Basic Part; Datasheet: https://item.szlcsc.com/datasheet/0603WAF1003T5E/26546.html; Supplier: LCSC; Type: Thick Film Resistor; Tolerance: ±1%; Power(Watts): 100mW; Voltage-Supply(Max): 75V; Temperature Coefficient: ±100ppm/℃; Operating Temperature: -55℃~+155℃
R26-R28 R30 R48 R49 R54 R60 R65 = 0603WAF1000T5E: Type:Thick Film Resistors Resistance: Tolerance:±1% Tolerance:±1% Power(Watts): Overload Voltage (Max): Temperature Coefficient:±200ppm/℃ Temperature Coefficient:±200ppm/℃ Operating Temperature Range:-55℃~+155℃ Operating Temperature Range:-55℃~+155℃; LCSC Part Name: 100Ω ±1% 100mW 厚膜电阻; Supplier Part: C22775; Manufacturer: UNI-ROYAL(厚声); Supplier Footprint: 0603; JLCPCB Part Class: Basic Part; Datasheet: https://atta.szlcsc.com/upload/public/pdf/source/20200306/C422600_1E6D84923E4A46A82E41ADD87F860B5C.pdf; Supplier: LCSC; Type: Thick Film Resistors; Tolerance: ±1%; Temperature Coefficient: ±200ppm/℃; Operating Temperature Range: -55℃~+155℃
R31 = 0603WAF4703T5E: Type:Thick Film Resistor Resistance:470kΩ Tolerance:±1% Tolerance:±1% Power(Watts):100mW Voltage-Supply(Max):75V Temperature Coefficient:±100ppm/℃ Temperature Coefficient:±100ppm/℃ Operating Temperature:-55℃~+155℃ Operating Temperature:-55℃~+155℃; LCSC Part Name: 470kΩ ±1% 100mW 厚膜电阻; Supplier Part: C23178; Manufacturer: UNI-ROYAL(厚声); Supplier Footprint: 0603; JLCPCB Part Class: Basic Part; Datasheet: https://item.szlcsc.com/datasheet/0603WAF4703T5E/23905.html; Supplier: LCSC; Type: Thick Film Resistor; Tolerance: ±1%; Power(Watts): 100mW; Voltage-Supply(Max): 75V; Temperature Coefficient: ±100ppm/℃; Operating Temperature: -55℃~+155℃
R33 R42 = 0603WAF4701T5E: Type:Thick Film Resistor Resistance:4.7kΩ Tolerance:±1% Tolerance:±1% Power(Watts):100mW Voltage-Supply(Max):75V Temperature Coefficient:±100ppm/℃ Temperature Coefficient:±100ppm/℃ Operating Temperature:-55℃~+155℃ Operating Temperature:-55℃~+155℃; LCSC Part Name: 4.7kΩ ±1% 100mW 厚膜电阻; Supplier Part: C23162; Manufacturer: UNI-ROYAL(厚声); Supplier Footprint: 0603; JLCPCB Part Class: Basic Part; Datasheet: https://item.szlcsc.com/datasheet/0603WAF4701T5E/23889.html; Supplier: LCSC; Type: Thick Film Resistor; Tolerance: ±1%; Power(Watts): 100mW; Voltage-Supply(Max): 75V; Temperature Coefficient: ±100ppm/℃; Operating Temperature: -55℃~+155℃
R34 = 0603WAF2203T5E: Type:Thick Film Resistor Resistance:220kΩ Tolerance:±1% Tolerance:±1% Power(Watts):100mW Voltage-Supply(Max):75V Temperature Coefficient:±100ppm/℃ Temperature Coefficient:±100ppm/℃ Operating Temperature:-55℃~+155℃ Operating Temperature:-55℃~+155℃; LCSC Part Name: 220kΩ ±1% 100mW 厚膜电阻; Supplier Part: C22961; Manufacturer: UNI-ROYAL(厚声); Supplier Footprint: 0603; JLCPCB Part Class: Basic Part; Datasheet: https://item.szlcsc.com/datasheet/0603WAF2203T5E/23688.html; Supplier: LCSC; Type: Thick Film Resistor; Tolerance: ±1%; Power(Watts): 100mW; Voltage-Supply(Max): 75V; Temperature Coefficient: ±100ppm/℃; Operating Temperature: -55℃~+155℃
R37 = CRCW1206100RFKEAHP: Type:Thick Film Resistors Resistance: Tolerance:±1% Tolerance:±1% Power(Watts): Temperature Coefficient:±100ppm/℃ Temperature Coefficient:±100ppm/℃ Operating Temperature:-55℃~+155℃ Operating Temperature:-55℃~+155℃; LCSC Part Name: 厚膜电阻 100Ω ±1% 750mW; Supplier Part: C844642; Manufacturer: VISHAY(威世); Supplier Footprint: 1206; JLCPCB Part Class: Extended Part; Datasheet: https://atta.szlcsc.com/upload/public/pdf/source/20221018/EBA0766182E7785923AA75C06FB4488F.pdf; Supplier: LCSC; Type: Thick Film Resistors; Tolerance: ±1%; Temperature Coefficient: ±100ppm/℃; Operating Temperature: -55℃~+155℃
R39 = AR03BTCX2703: Type:Thin Film Resistor Resistance:270kΩ Tolerance:±0.1% Tolerance:±0.1% Power(Watts):100mW Voltage-Supply(Max):75V Temperature Coefficient:±25ppm/℃ Temperature Coefficient:±25ppm/℃ Operating Temperature:-55℃~+155℃ Operating Temperature:-55℃~+155℃; LCSC Part Name: 薄膜电阻 270kΩ ±0.1% 100mW; Supplier Part: C2828628; Manufacturer: Viking(光颉); Supplier Footprint: 0603; JLCPCB Part Class: Extended Part; Datasheet: https://item.szlcsc.com/datasheet/AR03BTCX2703/2977097.html; Supplier: LCSC; Type: Thin Film Resistor; Tolerance: ±0.1%; Power(Watts): 100mW; Voltage-Supply(Max): 75V; Temperature Coefficient: ±25ppm/℃; Operating Temperature: -55℃~+155℃
R41 = 0603WAF2703T5E: Type:Thick Film Resistors Resistance:270kΩ Tolerance:±1% Tolerance:±1% Power(Watts): Overload Voltage (Max): Temperature Coefficient:±100ppm/℃ Temperature Coefficient:±100ppm/℃ Operating Temperature Range:-55℃~+155℃ Operating Temperature Range:-55℃~+155℃; LCSC Part Name: 270kΩ ±1% 100mW 厚膜电阻; Supplier Part: C22965; Manufacturer: UNI-ROYAL(厚声); Supplier Footprint: 0603; JLCPCB Part Class: Extended Part; Datasheet: https://atta.szlcsc.com/upload/public/pdf/source/20200306/C422600_1E6D84923E4A46A82E41ADD87F860B5C.pdf; Supplier: LCSC; Type: Thick Film Resistors; Tolerance: ±1%; Temperature Coefficient: ±100ppm/℃; Operating Temperature Range: -55℃~+155℃
R43 = 0603WAF2202T5E: Type:Thick Film Resistors Resistance:22kΩ Tolerance:±1% Tolerance:±1% Power(Watts): Overload Voltage (Max): Temperature Coefficient:±100ppm/℃ Temperature Coefficient:±100ppm/℃ Operating Temperature Range:-55℃~+155℃ Operating Temperature Range:-55℃~+155℃; LCSC Part Name: 22kΩ ±1% 100mW 厚膜电阻; Supplier Part: C31850; Manufacturer: UNI-ROYAL(厚声); Supplier Footprint: 0603; JLCPCB Part Class: Basic Part; Datasheet: https://atta.szlcsc.com/upload/public/pdf/source/20200306/C422600_1E6D84923E4A46A82E41ADD87F860B5C.pdf; Supplier: LCSC; Type: Thick Film Resistors; Tolerance: ±1%; Temperature Coefficient: ±100ppm/℃; Operating Temperature Range: -55℃~+155℃
R44 = 0603WAF3002T5E: Type:Thick Film Resistor Resistance:30kΩ Tolerance:±1% Tolerance:±1% Power(Watts):100mW Voltage-Supply(Max):75V Temperature Coefficient:±100ppm/℃ Temperature Coefficient:±100ppm/℃ Operating Temperature:-55℃~+155℃ Operating Temperature:-55℃~+155℃; LCSC Part Name: 30kΩ ±1% 100mW 厚膜电阻; Supplier Part: C22984; Manufacturer: UNI-ROYAL(厚声); Supplier Footprint: 0603; JLCPCB Part Class: Basic Part; Datasheet: https://item.szlcsc.com/datasheet/0603WAF3002T5E/23711.html; Supplier: LCSC; Type: Thick Film Resistor; Tolerance: ±1%; Power(Watts): 100mW; Voltage-Supply(Max): 75V; Temperature Coefficient: ±100ppm/℃; Operating Temperature: -55℃~+155℃
R47 = 0603WAF1200T5E: Type:Thick Film Resistors Resistance: Tolerance:±1% Tolerance:±1% Power(Watts): Overload Voltage (Max): Temperature Coefficient:±100ppm/℃ Temperature Coefficient:±100ppm/℃ Operating Temperature Range:-55℃~+155℃ Operating Temperature Range:-55℃~+155℃; LCSC Part Name: 120Ω ±1% 100mW 厚膜电阻; Supplier Part: C22787; Manufacturer: UNI-ROYAL(厚声); Supplier Footprint: 0603; JLCPCB Part Class: Basic Part; Datasheet: https://atta.szlcsc.com/upload/public/pdf/source/20200306/C422600_1E6D84923E4A46A82E41ADD87F860B5C.pdf; Supplier: LCSC; Type: Thick Film Resistors; Tolerance: ±1%; Temperature Coefficient: ±100ppm/℃; Operating Temperature Range: -55℃~+155℃
R53 = 0603WAF8200T5E: Type:Thick Film Resistor Resistance:820Ω Tolerance:±1% Tolerance:±1% Power(Watts):100mW Voltage-Supply(Max):75V Temperature Coefficient:±100ppm/℃ Temperature Coefficient:±100ppm/℃ Operating Temperature:-55℃~+155℃ Operating Temperature:-55℃~+155℃; LCSC Part Name: 820Ω ±1% 100mW 厚膜电阻; Supplier Part: C23253; Manufacturer: UNI-ROYAL(厚声); Supplier Footprint: 0603; JLCPCB Part Class: Basic Part; Datasheet: https://item.szlcsc.com/datasheet/0603WAF8200T5E/23980.html; Supplier: LCSC; Type: Thick Film Resistor; Tolerance: ±1%; Power(Watts): 100mW; Voltage-Supply(Max): 75V; Temperature Coefficient: ±100ppm/℃; Operating Temperature: -55℃~+155℃
R61 = 0603WAF5602T5E: Type:Thick Film Resistor Resistance:56kΩ Tolerance:±1% Tolerance:±1% Power(Watts):100mW Voltage-Supply(Max):75V Temperature Coefficient:±100ppm/℃ Temperature Coefficient:±100ppm/℃ Operating Temperature:-55℃~+155℃ Operating Temperature:-55℃~+155℃; LCSC Part Name: 56kΩ ±1% 100mW 厚膜电阻; Supplier Part: C23206; Manufacturer: UNI-ROYAL(厚声); Supplier Footprint: 0603; JLCPCB Part Class: Basic Part; Datasheet: https://item.szlcsc.com/datasheet/0603WAF5602T5E/23933.html; Supplier: LCSC; Type: Thick Film Resistor; Tolerance: ±1%; Power(Watts): 100mW; Voltage-Supply(Max): 75V; Temperature Coefficient: ±100ppm/℃; Operating Temperature: -55℃~+155℃
SW1 = CAS-120B1: Supplier Part: C3664598; Manufacturer: NIDEC(尼得科); JLCPCB Part Class: Extended Part; Datasheet: https://item.szlcsc.com/datasheet/CAS-120B1/4232397.html; Supplier: LCSC; Circuit: SPDT; Termination Style: Gull Wing; Mounting Type: Surface Mount,Vertical; Current Rating: 100mA; Voltage Rating: 6V; Life: 2,000 Cycles; Operating Temperature: -40℃~+85℃
SW2 = TS-1002S-05026C: LCSC Part Name: 6*6*5mm 立贴 轻触开关; Supplier Part: C455110; Manufacturer: XUNPU(讯普); Supplier Footprint: SMD,6x6mm; JLCPCB Part Class: Extended Part; Datasheet: https://atta.szlcsc.com/upload/public/pdf/source/20250513/F8F0C18C3D0EDC07DAC80A3CC3CDA783.pdf; Supplier: LCSC; Circuit: SPST; Actuator Style: Round Button; Mounting Type: Vertical welding; Length: 6mm; Width: 6mm; Switch Height: 5mm; Contact Current: 50mA; Voltage Rating: 12V
U1 = STM32F373CCT6: LCSC Part Name: ARMCortex-M4 32b MCU+FPU，Flash+SRAM，定时器，ADC，DAC，比较器，2.0 - 3.6V; Supplier Part: C89403; Manufacturer: ST(意法半导体); Supplier Footprint: LQFP-48(7x7); JLCPCB Part Class: Extended Part; Datasheet: https://atta.szlcsc.com/upload/public/pdf/source/20241127/8B6F308DCC530FE270436E313305134C.pdf; Supplier: LCSC; CPU Core: ARM-M4; CPU Maximum Speed: 72MHz; Program Storage Size: 256KB; Program Memory Type: FLASH; Number of I/O: 36; ADC (Bit): 16bit；12bit; DAC (Bit): 12bit; Voltage - Supply: 2V~3.6V
U2 U4 = BAV199_C5184419: Supplier Part: C5184419; Manufacturer: HXY MOSFET(华轩阳电子); Supplier Footprint: SOT-23; JLCPCB Part Class: Extended Part; Datasheet: https://item.szlcsc.com/datasheet/BAV199/5849855.html; Supplier: LCSC; Diode Configuration: 1 Pair Series Connection; Voltage - Forward(Vf@If): 1.25V@150mA; Voltage - DC Reverse(Vr): 70V; Current - Rectified: 215mA; Pd - Power Dissipation: 200mW; Reverse Leakage Current (Ir): 5nA@75V; Reverse Recovery Time (trr): 3us; Operating Junction Temperature Range: -55℃~+150℃; Non-Repetitive Peak Forward Surge Current: 1A
U3 = KH-2PH90-1X25P-L10.5: LCSC Part Name: 1x25P 间距:2mm 方针 弯插; Supplier Part: C19631087; Manufacturer: kinghelm(金航标); Supplier Footprint: 弯插,P=2mm; JLCPCB Part Class: Extended Part; Datasheet: https://item.szlcsc.com/datasheet/KH-2PH90-1X25P-L10.5/20923638.html; Supplier: LCSC; Pin Structure: 1x25P; Pitch: 2mm; Circluar Pins/Square Pins: Pin Header; Mounting Type: Right Angle; Number of Rows: 1; Number of Pins: 25P; Current Rating: 1.5A; Length of Mating Pin: 4mm; Insulation Height: 2mm; Contact Material: Brass; Contact Plating: Gold; Operating Temperature: -40℃~+105℃; Color: Black
U5 = TPS62162DSGR: Function:Step-down type Output Type:- Voltage - Supply:3V~17V Voltage - Supply:3V~17V Output Voltage:- Output Voltage:- Output Current:1A Frequency - Switching:2.25MHz Frequency - Switching:2.25MHz Operating Temperature:-40℃~+125℃@(TJ) Operating Temperatu; LCSC Part Name: TPS62162DSGR同步降压DC-DC转换器; Supplier Part: C40256; Manufacturer: TI(德州仪器); Supplier Footprint: WSON-8-EP(2x2); JLCPCB Part Class: Extended Part; Datasheet: https://www.ti.com/cn/lit/gpn/tps62162; Supplier: LCSC; Function: Step-down type; Voltage - Supply: 3V~17V; Output Current: 1A; Frequency - Switching: 2.25MHz; Operating Temperature: -40℃~+125℃@(TJ); Synchronous Rectifier: Yes; Number of Outputs: 1; Topology: Step-down; Switch tube (built-in/external): Built-in
U6 U8 U11 = JK-nSMD005/60V: LCSC Part Name: 60V 0.05A 1206自恢复; Supplier Part: C2830235; Manufacturer: JK(金科); Supplier Footprint: 1206; JLCPCB Part Class: Extended Part; Datasheet: https://item.szlcsc.com/datasheet/JK-nSMD005%252F60V/2981864.html; Supplier: LCSC; Voltage - Max: 60V; Current - Max: 100A; Hold Current: 50mA; Trip Current: 150mA; Resistance - Initial (Ri) (Min): 3.6Ω; Resistance - Post Trip (R1) (Max): 50Ω; Time to Trip(Max): 1.5s; Operating Temperature: -40℃~+85℃
U7 U10 = SMBJ18A_C19077573: LCSC Part Name: 单向TVS 18V截止 峰值浪涌电流：20.55A@10/1000us; Supplier Part: C19077573; Manufacturer: R+O(宏嘉诚); Supplier Footprint: DO-214AA(SMB); JLCPCB Part Class: Extended Part; Datasheet: https://item.szlcsc.com/datasheet/SMBJ18A/20275658.html; Supplier: LCSC; Polarity: Unidirectional; Reverse Stand-Off Voltage (Vrwm): 18V; Clamping Voltage: 29.2V; Peak Pulse Current (Ipp): 20.55A@10/1000us; Peak Pulse Power Dissipation (Ppp): 600W@10/1000us; Voltage - Breakdown: 22.1V; Reverse Leakage Current (Ir): 5uA; Operating Temperature: -55℃~+150℃; level of protection: IEC 61000-4-2; Type: TVS
U9 = TC-6615-9.0-160G: LCSC Part Name: 6*6*9mm 卧插 轻触开关; Supplier Part: C6575016; Manufacturer: HCTL(华灿天禄); Supplier Footprint: 插件; JLCPCB Part Class: Extended Part; Datasheet: https://atta.szlcsc.com/upload/public/pdf/source/20230523/20C79B748B4ACB531A66068A8A6BD305.pdf; Supplier: LCSC; Circuit: SPST; Actuator Style: Round Button; Operating Force: 160gf; Mounting Style: Horizontal Plug; Switch Length: 6mm; Switch Width: 6mm; Switch Height: 9mm; Strike Gundam: With bracket; Contact Current: 50mA; Voltage Rating (DC): 12V; Insulation Resistance: 100MΩ; Actuator/Cap Color: Black; With Lamp: None; Mechanical Life: 100000 Times; Operating Temperature: -25℃~+85℃
U12 = RS8905XM: LCSC Part Name: 微功耗比较器RS8905; Supplier Part: C5372656; Manufacturer: RUNIC(润石); Supplier Footprint: MSOP-8; JLCPCB Part Class: Extended Part; Datasheet: https://atta.szlcsc.com/upload/public/pdf/source/20230316/E9133064EE9D2ADCDC7D3DD82EE4887D.pdf; Supplier: LCSC; Number of Channels: 2; Vos - Input Offset Voltage: 3mV; Ib - Input Bias Current: 1pA; Propagation Delay Time: 9us; Output Type: TTL；CMOS; Rail to Rail: Rail-to-Rail Input, Rail-to-Rail Output; Quiescent Current: 400nA; Operating Temperature: -40℃~+125℃
U13 U14 = TLV9062IDR: LCSC Part Name: 适用于成本敏感型系统的10MHz、轨到轨输入输出（RRIO）CMOS运算放大器; Supplier Part: C398355; Manufacturer: TI(德州仪器); Supplier Footprint: SOIC-8; JLCPCB Part Class: Extended Part; Datasheet: https://www.ti.com/cn/lit/gpn/tlv9061; Supplier: LCSC; Number of Channels: 2; Maximum Power Supply Range (Vdd-Vss): 9V; Vos - Input Offset Voltage: 1.6mV; Input Offset Voltage Drift(Vos TC): 0.53uV/℃; Slew Rate: 6.5V/us; Ib - Input Bias Current: 0.5pA; Noise density(eN): 10nV/√Hz@1kHz; Common Mode Rejection Ratio(CMRR): 103dB; Operating Temperature: -40℃~+125℃; Single supply: 1.8V~5.5V
X1 = X50328MSB2GI: LCSC Part Name: YSX530GA 8MHZ 2P 5032 20PF ±10PPM -40~85℃ (±20PPM); Supplier Part: C115962; Manufacturer: YXC(扬兴晶振); Supplier Footprint: SMD5032-2P; JLCPCB Part Class: Basic Part; Datasheet: https://item.szlcsc.com/datasheet/X50328MSB2GI/117214.html; Supplier: LCSC; Type: Crystal Oscillator; Normal temperature Frequency Tolerance: ±10ppm; Load Capacitance: 20pF; Frequency Stability: ±20ppm; Operating Temperature: -40℃~+85℃

## Nets
+3V3: C1.1 C6.2 C7.1 C8.1 C9.1 C15.1 C16.2 CN1.1 H1.3 L1.2 L2.1 R5.2 R16.2 R25.2 R36.2 R50.2 R51.2 R52.2 U1.1(VBAT) U1.17(VDD_2) U1.48(VDD_1) U2.2 U3.9 U3.10 U4.2 U5.6(VOS) U12.8(V+)
+5V: C13.1 C14.1 C27.1 LED1.2(+) P1.2 SW1.3 U3.5 U3.6 U5.2(VIN)
+12V: U3.1 U3.2
GND: C1.2 C2.1 C3.1 C4.1 C5.1 C6.1 C7.2 C8.2 C9.2 C10.2 C11.2 C12.1 C13.2 C14.2 C15.2 C16.1 C17.1 C18.2 C19.2 C20.2 C21.2 C22.2 C23.2 C25.1 C26.1 C27.2 C28.1 C29.1 C30.1 CN1.3 CN1.5 CN1.9 CN2.1 CN2.2 D1.2(A) D2.2(A) D3.2(A) D4.2(A) D5.2(A) D6.2(A) D7.2(A) D8.2(A) D9.2(A) D10.2(A) D11.2 D13.2(A) D14.2 D15.2(A) D16.2(A) D17.2(A) D18.2(A) H1.1 P1.1 P2.2 Q3.3(D) Q4.3(D) Q6.3(D) R11.1 R12.1 R19.1 R20.1 R24.2 R31.2 R41.1 R44.1 R46.2 R55.2 R61.1 R62.2 R64.2 R66.2 SW2.3 SW2.4 U1.8(VSSAVREF-) U1.23(VSSSDVREFSD-) U1.47(VSS_1) U2.1 U3.3 U3.4 U3.7 U3.8 U3.11 U3.12 U4.1 U5.1(PGND) U5.4(AGND) U5.5(FB) U5.9(EP) U8.1 U9.2 U11.1 U12.4(V-) U13.4(VEE/GND) U14.4(VEE/GND)
VDDA: C10.1 C11.1 C17.2 C21.1 L2.2 Q1.2(S) R29.2 U1.9(VDDAVREF+) U1.24(VDDSD) U1.25(VREFSD+) U14.8(VCC)
BTN_FUNCTION: C29.2 R57.2 U1.38(PA15)
BTN_TOGGLE: C28.2 R56.2 U1.40(PB4)
CUR_SENSE: R58.1 U3.20
CUR_SENSE_ON: R10.1 U3.19
DEV_GND: C24.1 D12.1 U3.22
DEV_POS_IN: R4.2 U3.25
DEV_POS_OUT: R15.2 U3.24
DEV_POS_REL_IN: R37.1 U3.23
DEV_TEMP_P: P2.1 U6.1
ERROR: P1.5 Q5.3(D) U10.1(C)
FEEDBACK: P1.4 Q2.3(D) U7.1(C)
FEEDBACK_LED: R53.2 U1.18(PB0)
IND_LED_BLU: R54.2 U1.32(PA11)
IND_LED_GRN: R60.1 U1.45(PB8)
IND_LED_RED: R65.1 U1.35(PF6)
MCU_ANA_DEV_I: C30.2 R59.1 U1.20(PB2)
MCU_ANA_DEV_T: C23.1 R35.1 U1.22(PE9)
MCU_ANA_DEV_V: C25.2 R40.1 U1.19(PB1)
MCU_DIG_DEV_VS_IN: R9.2 U1.15(PA5)
MCU_DIG_DEV_VS_OUT: R18.2 U1.16(PA6)
MCU_ERROR: R63.1 U1.46(PB9)
MCU_FEEDBACK: R45.1 U1.31(PA10)
MCU_TOGGLE: R42.2 U1.30(PA9)
RELAY_OFF: R2.1 U3.18
RELAY_ON: R1.1 U3.17
RESET: C5.2 CN1.10 D9.1(C) R14.1 R50.1 SW2.1 SW2.2
SMBUS_ALERT: D1.1(C) R3.1 U3.15
SMBUS_CLK: D2.1(C) R6.1 U3.13
SMBUS_DATA: D3.1(C) R8.1 U3.14
STACK_ENABLED: SW1.1 U3.16
STL_COM_RX: R26.1 U1.12(PA2)
STL_COM_TX: R28.1 U1.13(PA3)
SWCLK: R23.1 U1.37(PA14)
SWDIO: R22.1 U1.34(PA13)
TEMP_SENSE_ON: R30.1 U1.14(PA4)
TOGGLE: P1.3 R43.1
TRACESWO: R27.1 U1.39(PB3)
$1N19200: C26.2 D13.1(C) D14.1 R36.1 R42.1 R43.2
$1N22381: Q2.2(S) U7.2(A) U8.2
$1N22471: D15.1(C) Q2.1(G) R45.2 R46.1
$1N22963: Q5.2(S) U10.2(A) U11.2
$1N22974: D18.1(C) Q5.1(G) R63.2 R64.1
$1N25868: LED1.3(-) R47.2
$1N25869: LED1.4(-) R48.2
$1N25870: LED1.1(-) R49.2
$1N25871: Q3.2(S) R49.1
$1N25872: Q4.2(S) R48.1
$1N25873: Q6.2(S) R47.1
$1N25880: CN2.4 R53.1
$1N27325: CN1.2 D5.1(C) R22.2
$1N27369: CN1.4 D6.1(C) R23.2
$1N27429: CN1.7 D4.1(C) R26.2
$1N27482: CN1.8 D8.1(C) R28.2
$1N27502: CN1.6 D7.1(C) R27.2
$1N28372: MCO1.1 R7.1
$1N28375: R7.2 U1.29(PA8)
$1N28501: R6.2 U1.42(PB6)
$1N28505: R8.2 U1.43(PB7)
$1N28510: R3.2 U1.41(PB5)
$1N29729: Q3.1(G) R54.1 R55.1
$1N29762: Q4.1(G) R60.2 R62.1
$1N29792: Q6.1(G) R65.2 R66.1
$1N31814: C4.2 U1.6(PF1-OSC_OUT) X1.1(OSC1)
$1N31822: C3.2 U1.5(PF0-OSC_IN) X1.2(OSC2)
$1N32151: CN2.3 D16.1(C) R51.1 R56.1
$1N32187: D17.1(C) R52.1 R57.1 U9.1
$1N32914: H1.2 R17.1
$1N32919: R17.2 U1.44(BOOT0)
$1N33023: R14.2 U1.7(NRST)
$1N47630: R39.2 R44.2 U14.3(INA+)
$1N47632: D12.2 R37.2 R38.1
$1N47633: C24.2 R38.2 R39.1
$1N47636: R40.2 U14.1(OUTA) U14.2(INA-)
$1N47862: R58.2 R61.2 U14.5(INB+)
$1N47864: R59.2 U14.6(INB-) U14.7(OUTB)
$1N48616: R9.1 R13.1 U12.1(OUTA)
$1N48618: C2.2 R4.1 R11.2 R13.2 U2.3 U12.3(INA+)
$1N48622: R5.1 R12.2 U12.2(INA-)
$1N48624: R18.1 R21.1 U12.7(OUTB)
$1N48627: C12.2 R15.1 R19.2 R21.2 U4.3 U12.5(INB+)
$1N48628: R16.1 R20.2 U12.6(INB-)
$1N49410: R34.2 U13.1(OUTA) U13.2(INA-)
$1N49411: R35.2 U13.6(INB-) U13.7(OUTB)
$1N49414: R34.1 R41.2 U13.5(INB+)
$1N49415: C22.1 R33.1 U13.3(INA+)
$1N49417: Q1.1(G) R29.1 R30.2
$1N49421: C19.1 C20.1 Q1.3(D) R31.1 R32.2 U13.8(VCC)
$1N49423: D10.1(C) D11.1 R32.1 R33.2 U6.2
$1N57152: R10.2 U1.33(PA12)
$1N57272: R1.2 U1.10(PA0)
$1N57312: R2.2 U1.11(PA1)
$1N71553: L1.1 U5.7(SW)
$1N71554: R25.1 U5.8(PG)
$1N71559: C18.1 R24.1 SW1.2 U5.3(EN)

Not connected (* = marked no-connect by the designer): U1 2(PC13)* 3(PC14-OSC32_IN)* 4(PC15-OSC32_OUT)* 21(PE8)* 26(PB14)* 27(PB15)* 28(PD8)* 36(PF7)*; U3 21*; U9 3* 4*

## Notes on the sheet
- MCU
- Device Voltage Comparator
- Baseboard Connector
- FT-PIN
- FT-PIN
- 1 cap at each pin, X7R, 50V, 0603
- Power Supply
- SWD Header
- Temperature Sensor Frontend
- R close to MCU
- Follow Datasheet
  For PCB Layout!
- TVS close to header
- Function Headers
- Device Voltage Measurement Frontend
- Digital Inputs
- 1.8V@18V
- Pulldown input
- 250R...320k
- RGB Indicator LED
- Toggle Button / Feedback LED
- Function Button
- Reset Button
- Current Sense
- Digital Outputs
- Pulldown output. Inductive
  loads require a flyback at the load!
- RC close to MCU
- RC close to MCU
- 1.62V@4.5V
- Pulldown output. Inductive
  loads require a flyback at the load!
